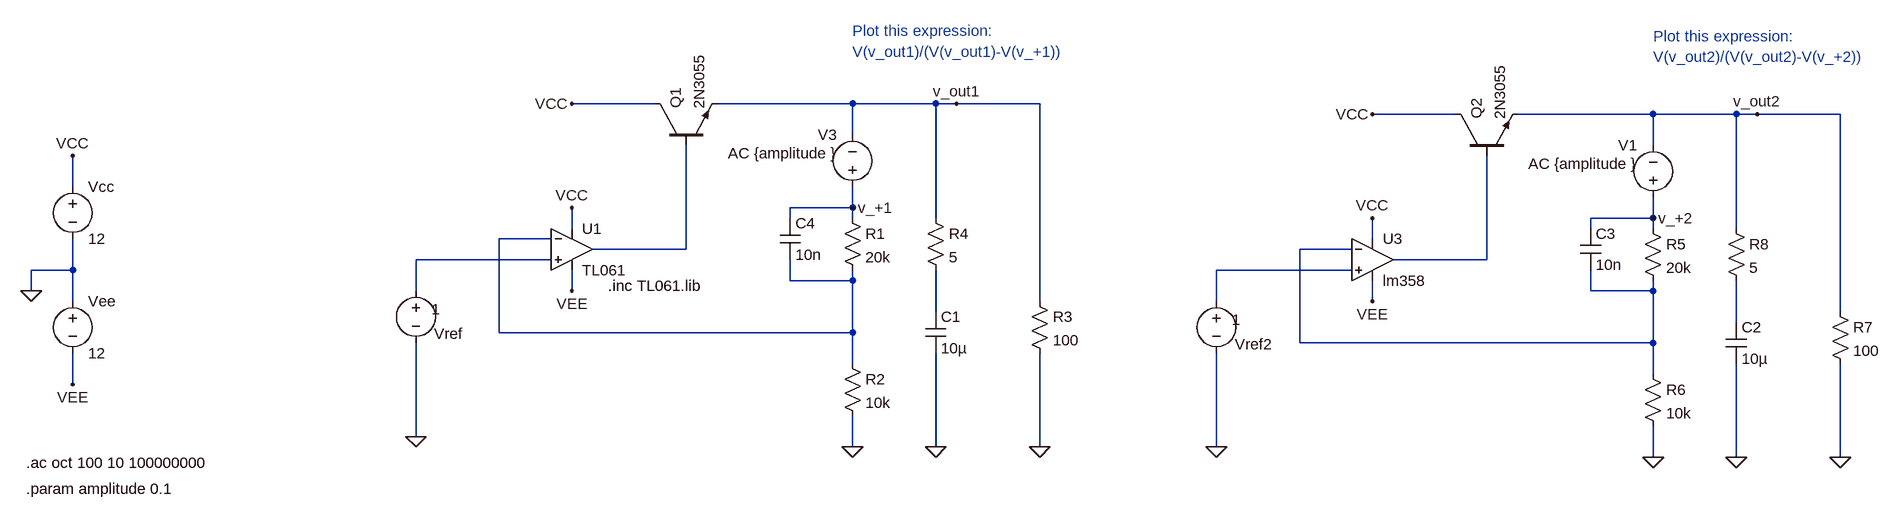
[diagram p0: schematic simplest_regulator_bode.asc]
simplest_regulator_bode.asc, the LTspice schematic file:
Version 4
SHEET 1 2232 680
WIRE 320 -176 192 -176
WIRE 624 -176 416 -176
WIRE 752 -176 624 -176
WIRE 784 -176 752 -176
WIRE 912 -176 784 -176
WIRE 1552 -160 1424 -160
WIRE 1856 -160 1648 -160
WIRE 1984 -160 1856 -160
WIRE 2016 -160 1984 -160
WIRE 2144 -160 2016 -160
WIRE 624 -128 624 -176
WIRE 1856 -112 1856 -160
WIRE -576 -48 -576 -96
WIRE 624 -16 624 -48
WIRE 624 -16 528 -16
WIRE 528 0 528 -16
WIRE 624 0 624 -16
WIRE 752 0 752 -176
WIRE 1856 0 1856 -32
WIRE 1856 0 1760 0
WIRE 192 16 192 -16
WIRE 1760 16 1760 0
WIRE 1856 16 1856 0
WIRE 1984 16 1984 -160
WIRE 160 32 80 32
WIRE 1424 32 1424 0
WIRE 368 48 368 -112
WIRE 368 48 224 48
WIRE 1392 48 1312 48
WIRE 160 64 -48 64
WIRE 1600 64 1600 -96
WIRE 1600 64 1456 64
WIRE -576 80 -576 32
WIRE -576 80 -640 80
WIRE 1392 80 1184 80
WIRE 528 96 528 64
WIRE 624 96 624 80
WIRE 624 96 528 96
WIRE -640 112 -640 80
WIRE -48 112 -48 64
WIRE 192 112 192 80
WIRE 1760 112 1760 80
WIRE 1856 112 1856 96
WIRE 1856 112 1760 112
WIRE -576 128 -576 80
WIRE 912 128 912 -176
WIRE 1184 128 1184 80
WIRE 1424 128 1424 96
WIRE 752 144 752 80
WIRE 2144 144 2144 -160
WIRE 1984 160 1984 96
WIRE 80 176 80 32
WIRE 624 176 624 96
WIRE 624 176 80 176
WIRE 1312 192 1312 48
WIRE 1856 192 1856 112
WIRE 1856 192 1312 192
WIRE 624 224 624 176
WIRE 1856 240 1856 192
WIRE -576 256 -576 208
WIRE -48 336 -48 192
WIRE 624 352 624 304
WIRE 752 352 752 208
WIRE 912 352 912 208
WIRE 1184 352 1184 208
WIRE 1856 368 1856 320
WIRE 1984 368 1984 224
WIRE 2144 368 2144 224
FLAG -640 112 0
FLAG -48 336 0
FLAG 192 -16 VCC
FLAG -576 -96 VCC
FLAG 192 112 VEE
FLAG -576 256 VEE
FLAG 624 352 0
FLAG 192 -176 VCC
FLAG 784 -176 v_out1
FLAG 752 352 0
FLAG 912 352 0
FLAG 624 -16 v_+1
FLAG 1184 352 0
FLAG 1424 0 VCC
FLAG 1424 128 VEE
FLAG 1856 368 0
FLAG 1424 -160 VCC
FLAG 2016 -160 v_out2
FLAG 1984 368 0
FLAG 2144 368 0
FLAG 1856 0 v_+2
SYMBOL OpAmps\\UniversalOpAmp2 192 48 R0
SYMATTR InstName U1
SYMATTR Value TL061
SYMBOL voltage -576 -64 R0
WINDOW 123 0 0 Left 0
WINDOW 39 0 0 Left 0
SYMATTR InstName Vcc
SYMATTR Value 12
SYMBOL voltage -576 112 R0
WINDOW 123 0 0 Left 0
WINDOW 39 0 0 Left 0
SYMATTR InstName Vee
SYMATTR Value 12
SYMBOL voltage -48 96 R0
WINDOW 123 24 124 Left 2
WINDOW 39 0 0 Left 0
WINDOW 0 28 82 Left 2
WINDOW 3 24 44 Left 2
SYMATTR InstName Vref
SYMATTR Value 1
SYMBOL res 608 -16 R0
SYMATTR InstName R1
SYMATTR Value 20k
SYMBOL res 608 208 R0
SYMATTR InstName R2
SYMATTR Value 10k
SYMBOL npn 320 -112 R270
SYMATTR InstName Q1
SYMATTR Value 2N3055
SYMBOL cap 736 144 R0
SYMATTR InstName C1
SYMATTR Value 10µ
SYMBOL res 896 112 R0
SYMATTR InstName R3
SYMATTR Value 100
SYMBOL voltage 624 -32 R180
WINDOW 0 24 96 Left 2
WINDOW 3 24 16 Left 2
WINDOW 123 24 68 Left 2
WINDOW 39 0 0 Left 0
SYMATTR InstName V3
SYMATTR Value ""
SYMATTR Value2 AC {amplitude }
SYMBOL res 736 -16 R0
SYMATTR InstName R4
SYMATTR Value 5
SYMBOL voltage 1184 112 R0
WINDOW 123 24 124 Left 2
WINDOW 39 0 0 Left 0
WINDOW 0 28 82 Left 2
WINDOW 3 24 44 Left 2
SYMATTR InstName Vref2
SYMATTR Value 1
SYMBOL res 1840 0 R0
SYMATTR InstName R5
SYMATTR Value 20k
SYMBOL res 1840 224 R0
SYMATTR InstName R6
SYMATTR Value 10k
SYMBOL npn 1552 -96 R270
SYMATTR InstName Q2
SYMATTR Value 2N3055
SYMBOL cap 1968 160 R0
SYMATTR InstName C2
SYMATTR Value 10µ
SYMBOL res 2128 128 R0
SYMATTR InstName R7
SYMATTR Value 100
SYMBOL voltage 1856 -16 R180
WINDOW 0 24 96 Left 2
WINDOW 3 24 16 Left 2
WINDOW 123 24 68 Left 2
WINDOW 39 0 0 Left 0
SYMATTR InstName V1
SYMATTR Value ""
SYMATTR Value2 AC {amplitude }
SYMBOL res 1968 0 R0
SYMATTR InstName R8
SYMATTR Value 5
SYMBOL lm358 1424 0 R0
SYMATTR InstName U3
SYMBOL cap 1744 16 R0
SYMATTR InstName C3
SYMATTR Value 10n
SYMBOL cap 512 0 R0
SYMATTR InstName C4
SYMATTR Value 10n
TEXT 248 104 Left 2 !.inc TL061.lib
TEXT -648 376 Left 2 !.ac oct 100 10 100000000
TEXT -648 416 Left 2 !.param amplitude 0.1
TEXT 624 -256 Left 2 ;V(v_out1)/(V(v_out1)-V(v_+1))
TEXT 624 -288 Left 2 ;Plot this expression:
TEXT 1856 -280 Left 2 ;Plot this expression:
TEXT 1856 -248 Left 2 ;V(v_out2)/(V(v_out2)-V(v_+2))

The netlist it stands for:
* simplest_regulator_bode.asc
XU1 N004 N001 VCC VEE N002 level2 TL061 Avol=1Meg GBW=10Meg Slew=10Meg Ilimit=25m Rail=0 Vos=0 En=0 Enk=0 In=0 Ink=0 Rin=500Meg  ; pins In+ In- V+ V- OUT
Vcc VCC 0 12
Vee 0 VEE 12
Vref N004 0 1
R1 v_+1 N001 20k
R2 N001 0 10k
Q1 VCC N002 v_out1 0 2N3055
C1 N007 0 10µ
R3 v_out1 0 100
V3 v_+1 v_out1 AC {amplitude }
R4 v_out1 N007 5
Vref2 N006 0 1
R5 v_+2 N003 20k
R6 N003 0 10k
Q2 VCC N005 v_out2 0 2N3055
C2 N008 0 10µ
R7 v_out2 0 100
V1 v_+2 v_out2 AC {amplitude }
R8 v_out2 N008 5
* U3: lm358 (symbol lm358 not available, pins judged from their places): In+=N006 In-=N003 V+=VCC V-=VEE OUT=N005
C3 v_+2 N003 10n
C4 v_+1 N001 10n
.model NPN NPN
.model PNP PNP
.lib standard.bjt
.inc TL061.lib
.ac oct 100 10 100000000
.param amplitude 0.1
* V(v_out1)/(V(v_out1)-V(v_+1))
* Plot this expression:
* Plot this expression:
* V(v_out2)/(V(v_out2)-V(v_+2))
.lib UniversalOpAmp2.lib
.backanno
.end